# EAGLE schematic stylophone (EAGLE 6.6.0)
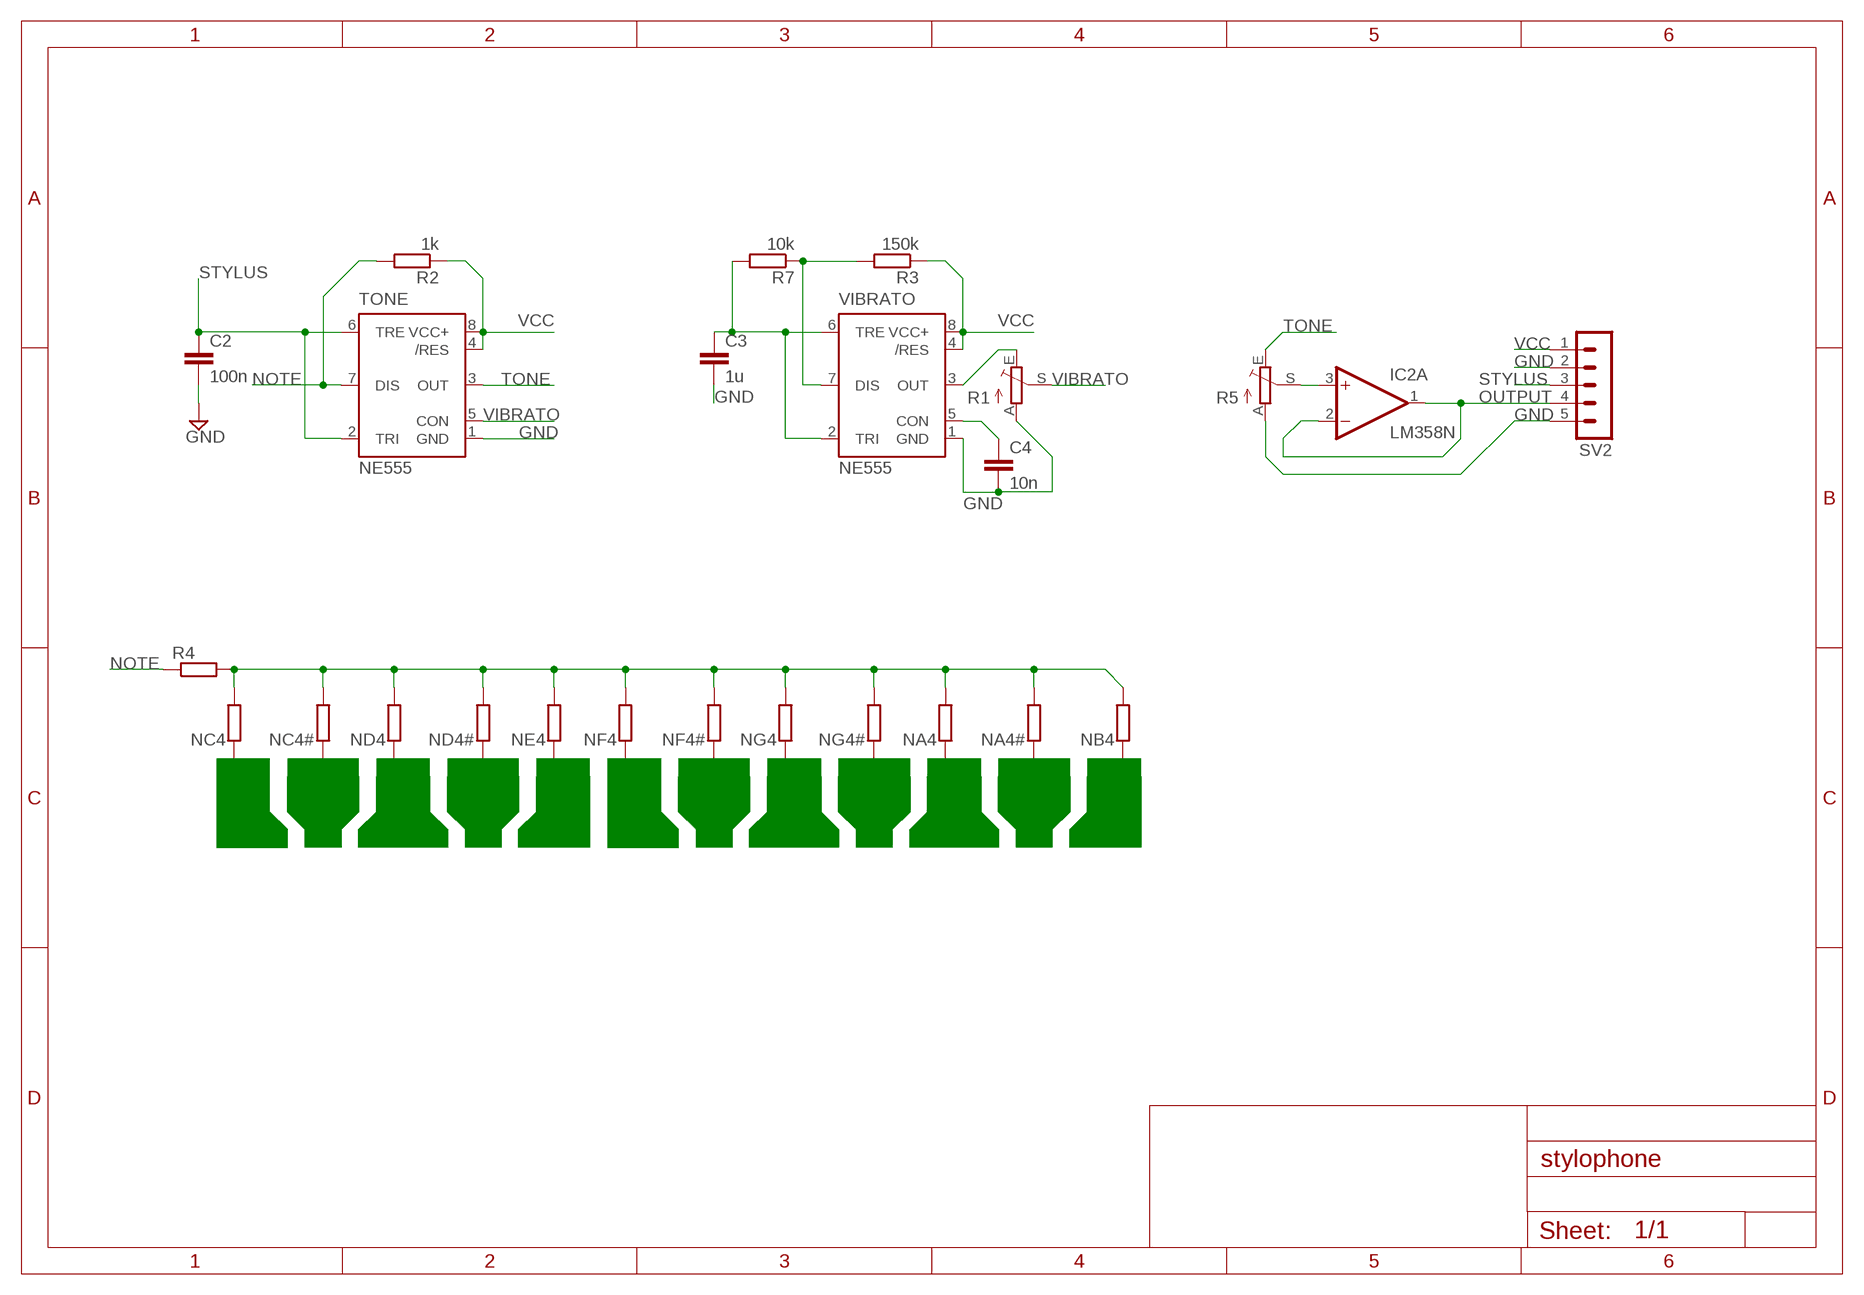
[diagram p0: schematic, sheet 1]

## Parts
C2  100n  C2.5/5  [C2.5-5]
C3  1u  C2.5/5  [C2.5-5]
C4  10n  C2.5/5  [C2.5-5]
IC2  LM358N  [DIL08]
NA4  R-EU_M1206  [M1206]
NA4#  R-EU_M1206  [M1206]
NB4  R-EU_M1206  [M1206]
NC4  R-EU_M1206  [M1206]
NC4#  R-EU_M1206  [M1206]
ND4  R-EU_M1206  [M1206]
ND4#  R-EU_M1206  [M1206]
NE4  R-EU_M1206  [M1206]
NF4  R-EU_M1206  [M1206]
NF4#  R-EU_M1206  [M1206]
NG4  R-EU_M1206  [M1206]
NG4#  R-EU_M1206  [M1206]
R1  TRIM_EU-CA9V  [CA9V]
R2  1k  R-EU_M1206  [M1206]
R3  150k  R-EU_M1206  [M1206]
R4  R-EU_0204/7  [0204/7]
R5  TRIM_EU-CA9V  [CA9V]
R7  10k  R-EU_M1206  [M1206]
SV2  MA05-1  [MA05-1]
TONE  NE555  [DIL-08]
VIBRATO  NE555  [DIL-08]

## Nets
GND: C2.2 C3.2 C4.2 R1.A R5.A SV2.2 SV2.5 TONE.1(GND) VIBRATO.1(GND)
KEYBOARD: NA4#.2 NA4.2 NB4.2 NC4#.2 NC4.2 ND4#.2 ND4.2 NE4.2 NF4#.2 NF4.2 NG4#.2 NG4.2 R4.2
N$1: C4.1 VIBRATO.5(CON)
N$2: R1.E VIBRATO.3(OUT)
N$3: R3.2 R7.1 VIBRATO.7(DIS)
N$5: IC2.3(A:+IN) R5.S
NOTE: R2.2 R4.1 TONE.7(DIS)
NOTSTYLUS: C3.1 R7.2 VIBRATO.2(TRI) VIBRATO.6(TRE)
OUTPUT: IC2.1(A:OUT) IC2.2(A:-IN) SV2.4
STYLUS: C2.1 SV2.3 TONE.2(TRI) TONE.6(TRE)
TONE: R5.E TONE.3(OUT)
VCC: R2.1 R3.1 SV2.1 TONE.4(/RES) TONE.8(VCC+) VIBRATO.4(/RES) VIBRATO.8(VCC+)
VIBRATO: R1.S TONE.5(CON)
Unconnected: IC2.5(B:+IN) IC2.6(B:-IN) IC2.7(B:OUT) NA4#.1 NA4.1 NB4.1 NC4#.1 NC4.1 ND4#.1 ND4.1 NE4.1 NF4#.1 NF4.1 NG4#.1 NG4.1

## Power pins joined to a net without a drawn wire
V+: IC2.8(P:V+)
V-: IC2.4(P:V-)

## Library data of the parts
C2-C4 = capacitor-wima:C: CAPACITOR naming: grid - package width
IC2 = linear:LM358: OP AMP also LM158; LM258; LM2904 Source: http://cache.national.com/ds/LM/LM158.pdf
NA4 NA4# NB4 NC4 NC4# ND4 ND4# NE4 NF4 NF4# NG4 NG4# R2 R3 R7 = resistor:R-EU_: RESISTOR, European symbol
R1 R5 = pot:TRIM_EU-: POTENTIOMETER
R4 = rcl:R-EU_: RESISTOR, European symbol
SV2 = con-lstb:MA05-1: PIN HEADER; OC_FARNELL: unknown; OC_NEWARK: unknown
TONE VIBRATO = st-microelectronics:NE555: General purpose bipolar Timer; MF: Arrow Electronics; MPN: NE555N; OC_FARNELL: 1467742; OC_NEWARK: 89K1486